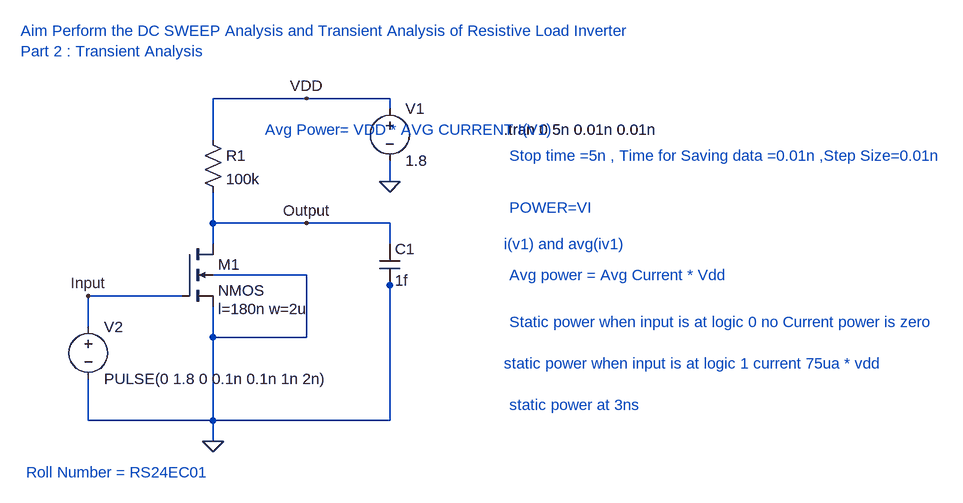
[diagram p0: schematic Exp1 VTC_Resistive_Inverter.TransientAnalysisVin_vout_time.asc]
Exp1 VTC_Resistive_Inverter.TransientAnalysisVin_vout_time.asc, the LTspice schematic file:
Version 4
SHEET 1 1584 680
WIRE 448 -112 304 -112
WIRE 576 -112 448 -112
WIRE 576 -96 576 -112
WIRE 304 -48 304 -112
WIRE 576 16 576 -16
WIRE 304 80 304 32
WIRE 448 80 304 80
WIRE 576 80 448 80
WIRE 304 112 304 80
WIRE 576 112 576 80
WIRE 448 160 304 160
WIRE 576 176 576 160
WIRE 256 192 112 192
WIRE 112 240 112 192
WIRE 304 256 304 208
WIRE 448 256 448 160
WIRE 448 256 304 256
WIRE 112 384 112 320
WIRE 304 384 304 256
WIRE 304 384 112 384
WIRE 576 384 576 176
WIRE 576 384 304 384
WIRE 304 416 304 384
FLAG 576 16 0
FLAG 304 416 0
FLAG 112 192 Input
FLAG 448 80 Output
FLAG 448 -112 VDD
SYMBOL res 288 -64 R0
SYMATTR InstName R1
SYMATTR Value 100k
SYMBOL cap 560 112 R0
SYMATTR InstName C1
SYMATTR Value 1f
SYMBOL voltage 576 -112 R0
WINDOW 123 0 0 Left 0
WINDOW 39 0 0 Left 0
SYMATTR InstName V1
SYMATTR Value 1.8
SYMBOL voltage 112 224 R0
WINDOW 123 0 0 Left 0
WINDOW 39 0 0 Left 0
SYMATTR InstName V2
SYMATTR Value PULSE(0 1.8 0 0.1n 0.1n 1n 2n)
SYMBOL nmos4 256 112 R0
WINDOW 123 56 100 Left 2
SYMATTR Value2 l=180n w=2u
SYMATTR InstName M1
TEXT 8 -216 Left 2 ;Aim Perform the DC SWEEP Analysis and Transient Analysis of Resistive Load Inverter\nPart 2 : Transient Analysis
TEXT 16 464 Left 2 ;Roll Number = RS24EC01
TEXT 752 -64 Left 2 !.tran 0 5n 0.01n 0.01n
TEXT 760 -24 Left 2 ;Stop time =5n , Time for Saving data =0.01n ,Step Size=0.01n
TEXT 760 56 Left 2 ;POWER=VI
TEXT 752 112 Left 2 ;i(v1) and avg(iv1)
TEXT 384 -64 Left 2 ;Avg Power= VDD * AVG CURRENT I(V1)
TEXT 760 160 Left 2 ;Avg power = Avg Current * Vdd
TEXT 760 232 Left 2 ;Static power when input is at logic 0 no Current power is zero
TEXT 752 296 Left 2 ;static power when input is at logic 1 current 75ua * vdd
TEXT 760 360 Left 2 ;static power at 3ns

The netlist it stands for:
* Exp1 VTC_Resistive_Inverter.TransientAnalysisVin_vout_time.asc
R1 VDD Output 100k
C1 Output 0 1f
V1 VDD 0 1.8
V2 Input 0 PULSE(0 1.8 0 0.1n 0.1n 1n 2n)
M1 Output Input 0 0 NMOS l=180n w=2u
.model NMOS NMOS
.model PMOS PMOS
.lib standard.mos
* Aim Perform the DC SWEEP Analysis and Transient Analysis of Resistive Load Inverter
* Part 2 : Transient Analysis
* Roll Number = RS24EC01
.tran 0 5n 0.01n 0.01n
* Stop time =5n , Time for Saving data =0.01n ,Step Size=0.01n
* POWER=VI
* i(v1) and avg(iv1)
* Avg Power= VDD * AVG CURRENT I(V1)
* Avg power = Avg Current * Vdd
* Static power when input is at logic 0 no Current power is zero
* static power when input is at logic 1 current 75ua * vdd
* static power at 3ns
.backanno
.end

* Results of the author's LTspice run, read from the files saved beside the schematic
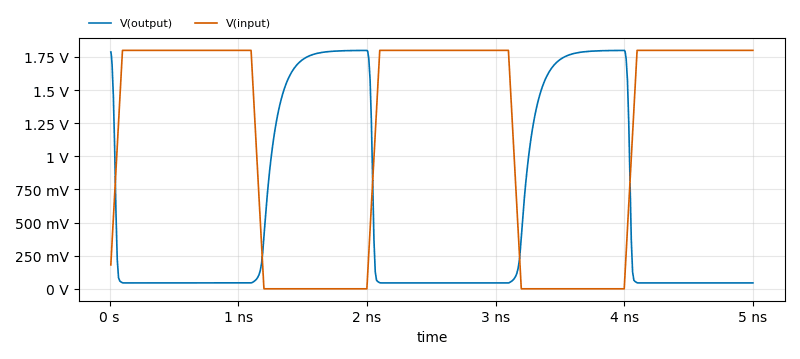
[diagram p1: Transient Analysis of Exp1 VTC_Resistive_Inverter.TransientAnalysisVin_vout_time.asc, plotted from the saved traces]
* Transient Analysis, 1 run:
*   V(output): min 44.44 mV, max 1.8 V, average 594.8 mV, rms 968.4 mV, last 44.44 mV
*   V(input): min 0 V, max 1.8 V, average 1.136 V, rms 1.411 V, last 1.8 V